# Altium schematic sheet SCH - Wireless Coms.SchDoc
size A4; CompanyName: James Cook University; DrawnBy1: Jacob Finger; Organization: James Cook University; Title1: Assignment 2 - qfuse; Revision: 1.6; SheetNumber: 4; SheetTotal: 4; Title2: Wireless Coms; DrawnBy2: Liam McLaren; ProjectName: *ProjectName
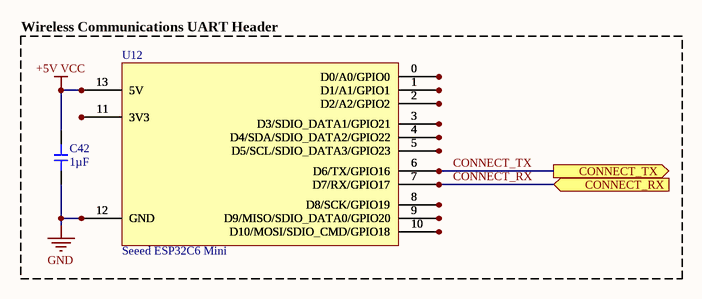
[diagram p0: SCH - Wireless Coms.SchDoc]

## Parts
C42  value 1µF  [CAP-0402]  (hidden comment: CL05A105KA5NQNC)
U12  Seeed ESP32C6 Mini  [ESP32C6 Mini]  (no BOM)

## Blocks framed on the sheet
Wireless Communications UART Header: C42 U12

## Ports
CONNECT_RX (in, see SCH - Compute, Flash[3C], SCH - Power, Connector[4A]), CONNECT_TX (out, see SCH - Compute, Flash[3C], SCH - Power, Connector[4A])

## Nets
+5V VCC: C42.2 U12.13(5V)
GND: C42.1 U12.12(GND)
CONNECT_RX: U12.7(D7/RX/GPIO17) ; port CONNECT_RX
CONNECT_TX: U12.6(D6/TX/GPIO16) ; port CONNECT_TX

Not connected (* = marked no-connect by the designer): U12 0(D0/A0/GPIO0) 1(D1/A1/GPIO1) 2(D2/A2/GPIO2) 3(D3/SDIO_DATA1/GPIO21) 4(D4/SDA/SDIO_DATA2/GPIO22) 5(D5/SCL/SDIO_DATA3/GPIO23) 8(D8/SCK/GPIO19) 9(D9/MISO/SDIO_DATA0/GPIO20) 10(D10/MOSI/SDIO_CMD/GPIO18) 11(3V3)

## Notes on the sheet
- Date:
- Sheet
- of
- Time:
- Revision:
- Drawn by:
- File:

## Library data of the parts
C42 = CMP-001-00140-3: Capacitor, Ceramic (MLCC), 1uF, ±10%, 25V, X5R, ±10%, SMD 0402; Manufacturer: Samsung Electro-Mechanics; Case/Package: 0402; ComponentLink2Description: JLCPCB Part URL; Manufacturer Part Number: CL05A105KA5NQNC; RoHS: Yes; Temperature Coefficient: X5R; Tolerance: 10%; ComponentLink2URL: https://jlcpcb.com/partdetail/C52923; ComponentLink1URL: https://datasheet.lcsc.com/lcsc/1811091611_Samsung-Electro-Mechanics-CL05A105KA5NQNC_C52923.pdf; ComponentLink3URL: https://lcsc.com/product-detail/Multilayer-Ceramic-Capacitors-MLCC---SMD-SMT_Samsung-Electro-Mechanics-Samsung-Electro-Mechanics-CL05A105KA5NQNC_C52923.html; ComponentLink1Description: Datasheet; ComponentLink3Description: LCSC Part URL; JLCPCB Basic Part: Yes; Design Item ID: CL05A105KA5NQNC; JLCPCB Part Number: C52923; Source: jlcpcb_capacitors_basic.schlib; Category: Capacitors - MLCC; Voltage Rating: 25V
U12 = ESP32C6 Mini